# EAGLE design midi_in (EAGLE 5.07)
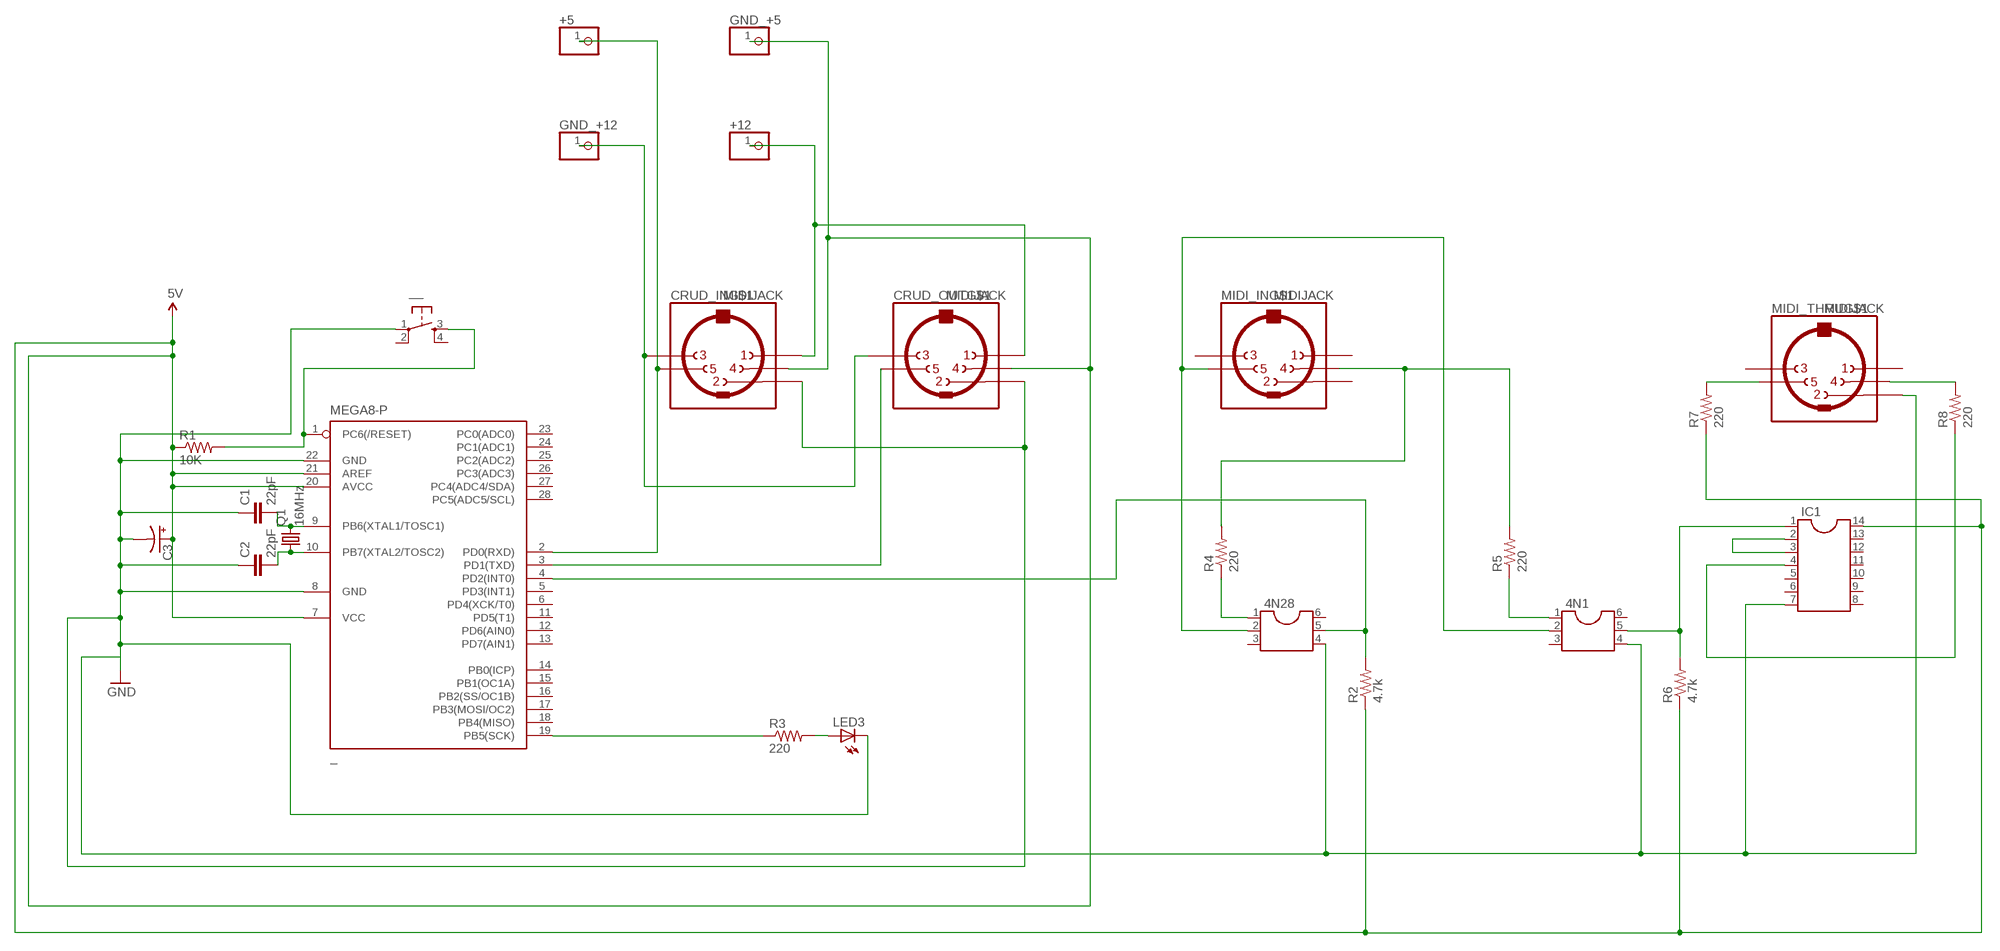
[diagram p0: schematic, sheet 1]

## Parts
4N1  DIL6  [DIL06]
4N28  DIL6  [DIL06]
+5  PINHD-1X1  [1X01]
+12  PINHD-1X1  [1X01]
_  MEGA8-P  [DIL28-3]
__  TAC_SWITCHPTH  [TACTILE-PTH]
C1  22pF  CAPPTH  [CAP-PTH-SMALL]
C2  22pF  CAPPTH  [CAP-PTH-SMALL]
C3  CAP_POLPTH2  [CPOL-RADIAL-10UF-25V]
CRUD_IN  MIDIJACK  [CP-2350]
CRUD_OUT  MIDIJACK  [CP-2350]
GND_+5  PINHD-1X1  [1X01]
GND_+12  PINHD-1X1  [1X01]
IC1  DIL14  [DIL14]
LED3  LED5MM  [LED5MM]
MIDI_IN  MIDIJACK  [CP-2350]
MIDI_THRU  MIDIJACK  [CP-2350]
Q1  16MHz  CRYSTALHC49U-V  [HC49U-V]
R1  10K  RESISTORPTH-1/6W  [1/6W-RES]
R2  4.7k  RESISTORPTH-1/6W  [1/6W-RES]
R3  220  RESISTORPTH-1/6W  [1/6W-RES]
R4  220  RESISTORPTH-1/6W  [1/6W-RES]
R5  220  RESISTORPTH-1/6W  [1/6W-RES]
R6  4.7k  RESISTORPTH-1/6W  [1/6W-RES]
R7  220  RESISTORPTH-1/6W  [1/6W-RES]
R8  220  RESISTORPTH-1/6W  [1/6W-RES]

## Nets
5V: _.7(VCC) _.20(AVCC) _.21(AREF) C3.1(+) CRUD_IN.4 CRUD_OUT.4 GND_+5.1 IC1.14 R1.1 R2.1 R6.1 R7.1
GND: 4N1.4 4N28.4 _.8(GND) _.22(GND) __.1 C1.1 C2.1 C3.2(-) CRUD_IN.2 CRUD_OUT.2 IC1.7 LED3.K(C) MIDI_THRU.2
N$1: _.1(PC6(/RESET)) __.3 R1.2
N$2: _.9(PB6(XTAL1/TOSC1)) C1.2 Q1.2
N$3: _.10(PB7(XTAL2/TOSC2)) C2.2 Q1.1
N$4: _.19(PB5(SCK)) R3.1
N$5: +5.1 _.2(PD0(RXD)) CRUD_IN.5
N$6: _.3(PD1(TXD)) CRUD_OUT.5
N$7: CRUD_IN.3 CRUD_OUT.3 GND_+12.1
N$8: +12.1 CRUD_IN.1 CRUD_OUT.1
N$9: 4N28.5 _.4(PD2(INT0)) R2.2
N$10: 4N28.1 R4.1
N$11: MIDI_IN.4 R4.2 R5.2
N$12: LED3.A R3.2
N$13: 4N1.2 4N28.2 MIDI_IN.5
N$15: 4N1.1 R5.1
N$16: 4N1.5 IC1.1 R6.2
N$18: IC1.2 IC1.3
N$19: MIDI_THRU.5 R7.2
N$20: MIDI_THRU.4 R8.2
N$22: IC1.4 R8.1
Unconnected: 4N1.3 4N1.6 4N28.3 4N28.6 _.5(PD3(INT1)) _.6(PD4(XCK/T0)) _.11(PD5(T1)) _.12(PD6(AIN0)) _.13(PD7(AIN1)) _.14(PB0(ICP)) _.15(PB1(OC1A)) _.16(PB2(SS/OC1B)) _.17(PB3(MOSI/OC2)) _.18(PB4(MISO)) _.23(PC0(ADC0)) _.24(PC1(ADC1)) _.25(PC2(ADC2)) _.26(PC3(ADC3)) _.27(PC4(ADC4/SDA)) _.28(PC5(ADC5/SCL)) __.2 __.4 CRUD_IN.PE1(MT) CRUD_IN.PE2(MT) CRUD_IN.PE(MT) CRUD_IN.PE@(MT) CRUD_OUT.PE1(MT) CRUD_OUT.PE2(MT) CRUD_OUT.PE(MT) CRUD_OUT.PE@(MT) IC1.5 IC1.6 IC1.8 IC1.9 IC1.10 IC1.11 IC1.12 IC1.13 MIDI_IN.1 MIDI_IN.2 MIDI_IN.3 MIDI_IN.PE1(MT) MIDI_IN.PE2(MT) MIDI_IN.PE(MT) MIDI_IN.PE@(MT) MIDI_THRU.1 MIDI_THRU.3 MIDI_THRU.PE1(MT) MIDI_THRU.PE2(MT) MIDI_THRU.PE(MT) MIDI_THRU.PE@(MT)

## Library data of the parts
4N1 4N28 = ic-package:DIL6: Dual In Line / Socket
+5 +12 GND_+5 GND_+12 = pinhead:PINHD-1X1: PIN HEADER
_ = atmel:MEGA8-P: MICROCONTROLLER 8 Kbytes FLASH, 1 kbytes SRAM, 512 bytes EEPROM, USART, 4-channel 10 bit ADC, 2-channel 8 bit ADC Pin compatible with Atmega48, ATMega88, ATMega168 Source: avr.lbr
__ = SparkFun:TAC_SWITCH: Momentary Switch Button commonly used for reset or general input. Spark Fun Electronics SKU : COM-00097
C1 C2 = SparkFun:CAP: Capacitor Standard 0603 ceramic capacitor, and 0.1" leaded capacitor.
C3 = SparkFun:CAP_POL: Capacitor Polarized These are standard SMD and PTH capacitors. Normally 10uF, 47uF, and 100uF in electrolytic and tantalum varieties. Always verify the external diameter of the through hole cap, it varies with capacity, voltage, and manufacturer. The EIA devices should be standard.
CRUD_IN CRUD_OUT MIDI_IN MIDI_THRU = adafruit:MIDIJACK: DIN 5 jack also known as MIDI jack A modification of conn-hirshman:MAB5SH with two options for the grounding 'teeth'
IC1 = ic-package:DIL14: Dual In Line / Socket
LED3 = adafruit:LED: LED OSRAM: - CHIPLED LG R971, LG N971, LY N971, LG Q971, LY Q971, LO R971, LY R971 LH N974, LH R974 LS Q976, LO Q976, LY Q976 LO Q996 - Hyper CHIPLED LW Q18S LB Q993, LB Q99A, LB R99A - SideLED LS A670, LO A670, LY A670, LG A670, LP A670 LB A673, LV A673, LT A673, LW A673 LH A674 LY A675 LS A676, LA A676, LO A676, LY A676, LW A676 LS A679, LY A679, LG A679 - Hyper Micro SIDELED® LS Y876, LA Y876, LO Y876, LY Y876 LT Y87S - SmartLED LW L88C, LW L88S LB L89C, LB L89S, LG L890 LS L89K, LO L89K, LY L89K LS L896, LA L896, LO L896, LY L896 - TOPLED LS T670, LO T670, LY T670, LG T670, LP T670 LSG T670, LSP T670, LSY T670, LOP T670, LYG T670 LG T671, LOG T671, LSG T671 LB T673, LV T673, LT T673, LW T673 LH T674 LS T676, LA T676, LO T676, LY T676, LB T676, LH T676, LSB T676, LW T676 LB T67C, LV T67C, LT T67C, LS T67K, LO T67K, LY T67K, LW E67C LS E67B, LA E67B, LO E67B, LY E67B, LB E67C, LV E67C, LT E67C LW T67C LS T679, LY T679, LG T679 LS T770, LO T770, LY T770, LG T770, LP T770 LB T773, LV T773, LT T773, LW T773 LH T774 LS E675, LA E675, LY E675, LS T675 LS T776, LA T776, LO T776, LY T776, LB T776 LHGB T686 LT T68C, LB T68C - Hyper Mini TOPLED® LB M676 - Mini TOPLED Santana® LG M470 LS M47K, LO M47K, LY M47K Source: http://www.osram.convergy.de/
Q1 = crystal:CRYSTAL: CRYSTAL
R1-R8 = SparkFun:RESISTOR: Resistor Basic schematic elements and footprints for 0603, 1206, and PTH resistors.

## Board
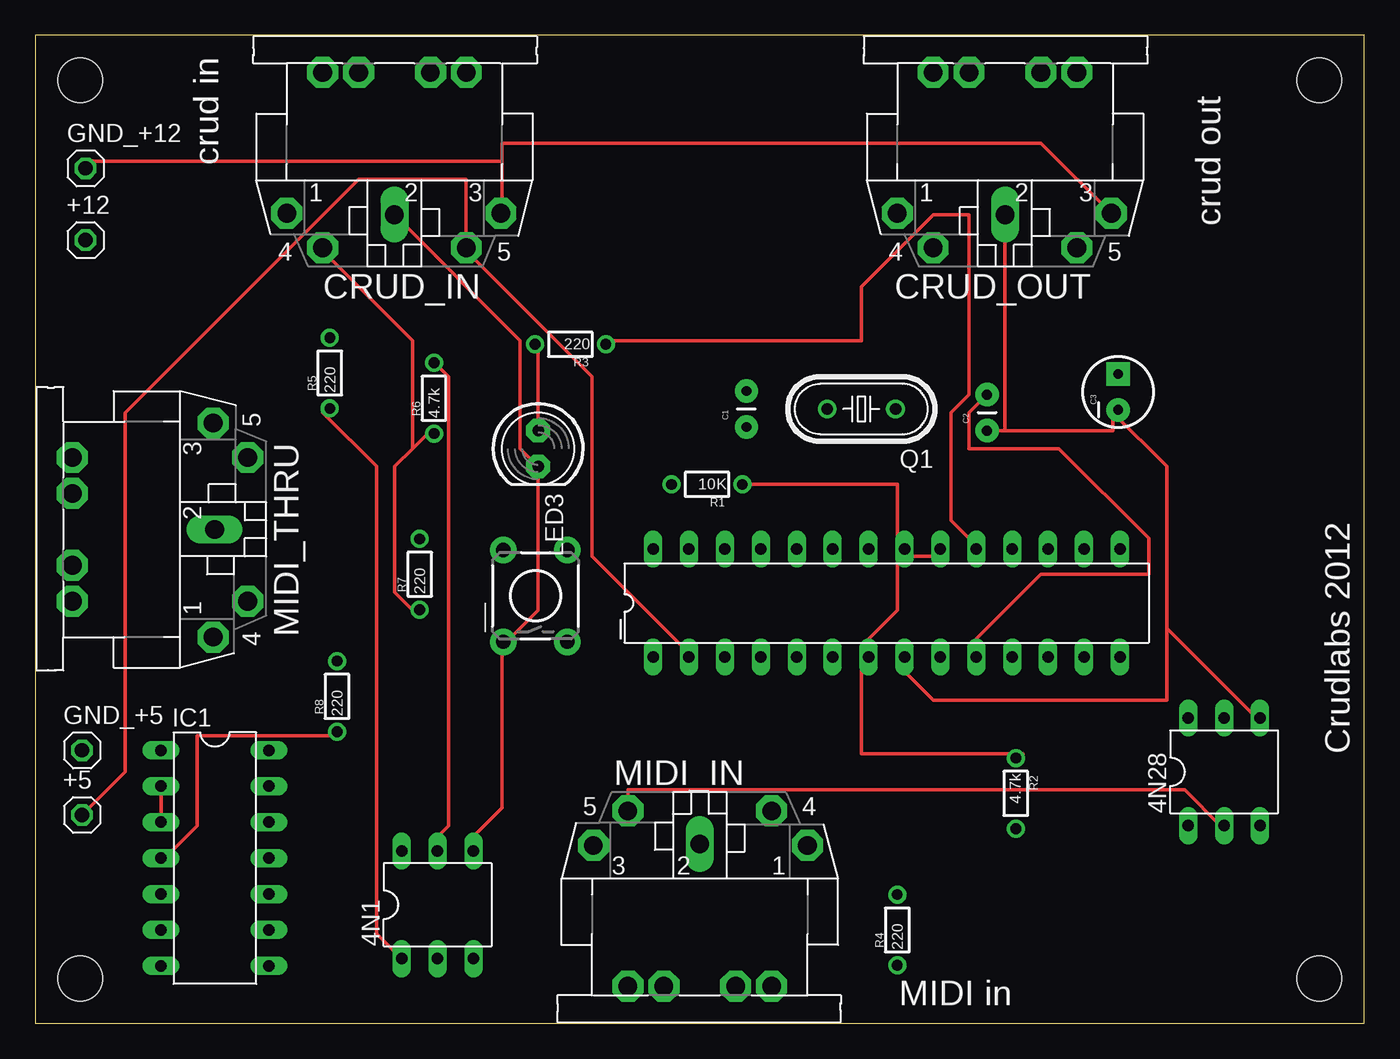
[diagram p1: board, top side]
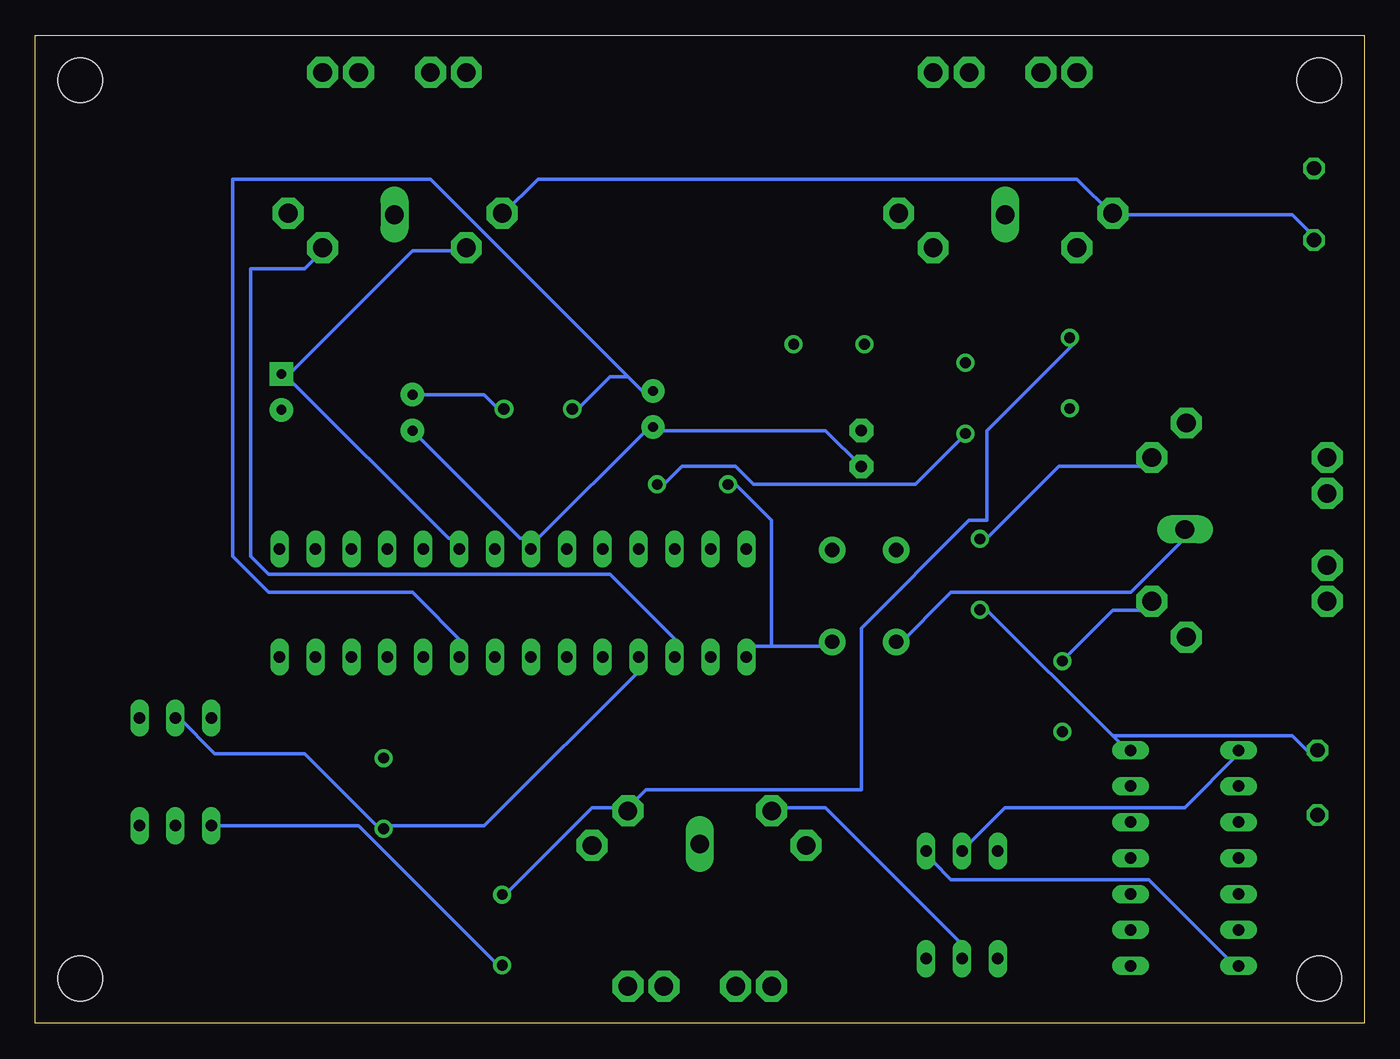
[diagram p2: board, bottom side, seen from below]

Size 93.98 x 69.85 mm. Coordinates in mm from the lower left corner, seen from the top.
Outline: 0,0 93.98,0 93.98,69.85 0,69.85 0,0
Copper layers (1*16): Top 0.035mm / dielectric 1.5mm / Bottom 0.035mm
Design rules "default": minimum track width 10mil, minimum drill 24mil, track to track 8mil, track to pad 8mil, pad to pad 8mil, via to via 8mil, smd to smd 8mil, copper to edge 40mil, drill to drill 8mil, minimum pad ring 10mil, minimum via ring 8mil, stop-mask expansion 4mil, vias tented up to drill 0mil, thermal gap 10mil
Holes 3.17 mm at 3.17,66.67 90.81,3.17 90.81,66.67 3.17,3.17

### Footprints (pad centres in the part's own frame; a part is rotated, then mirrored left to right if it is on the bottom)
DIL06 = drill 0.813 long: 1 -2.54,-3.81; 2 0,-3.81; 3 2.54,-3.81; 4 2.54,3.81; 5 0,3.81; 6 -2.54,3.81
1X01 = drill 1.016 octagon: 1 0,0
DIL28-3 = drill 0.813 long: 1 -16.51,-3.81; 2 -13.97,-3.81; 3 -11.43,-3.81; 4 -8.89,-3.81; 5 -6.35,-3.81; 6 -3.81,-3.81; 7 -1.27,-3.81; 8 1.27,-3.81; 9 3.81,-3.81; 10 6.35,-3.81; 11 8.89,-3.81; 12 11.43,-3.81; 13 13.97,-3.81; 14 16.51,-3.81; 15 16.51,3.81; 16 13.97,3.81; 17 11.43,3.81; 18 8.89,3.81; 19 6.35,3.81; 20 3.81,3.81; 21 1.27,3.81; 22 -1.27,3.81; 23 -3.81,3.81; 24 -6.35,3.81; 25 -8.89,3.81; 26 -11.43,3.81; 27 -13.97,3.81; 28 -16.51,3.81
TACTILE-PTH = drill 1.016 pad 1.88 round: 1 -3.251,2.261; 2 3.251,2.261; 3 -3.251,-2.261; 4 3.251,-2.261
CAP-PTH-SMALL = drill 0.7 pad 1.651 round: 1 0,0; 2 2.54,0
CPOL-RADIAL-10UF-25V = drill 0.7 pad 1.651 square: 1 1.27,0 | drill 0.7 pad 1.651 round: 2 -1.27,0
CP-2350 = drill 1.321 pad 2.184 octagon: 1 7.62,12.58; 3 -7.52,12.58; 4 5.08,15.02; 5 -5.08,15.02; PE -2.54,2.62; PE1 -5.08,2.62; PE2 5.08,2.62; PE@ 2.54,2.62 | drill 1.321 long: 2 0,12.68
DIL14 = drill 0.813 long: 1 -7.62,-3.81; 2 -5.08,-3.81; 3 -2.54,-3.81; 4 0,-3.81; 5 2.54,-3.81; 6 5.08,-3.81; 7 7.62,-3.81; 8 7.62,3.81; 9 5.08,3.81; 10 2.54,3.81; 11 0,3.81; 12 -2.54,3.81; 13 -5.08,3.81; 14 -7.62,3.81
LED5MM = drill 0.813 pad 1.676 octagon: A -1.27,0; K 1.27,0
HC49U-V = drill 0.813 round: 1 -2.413,0; 2 2.413,0
1/6W-RES = drill 0.762 round: 1 -2.5,0; 2 2.5,0

### Placement (x,y rotation side)
4N1  28.45,8.38 0 top
4N28  84.07,17.78 0 top
+5  3.3,14.73 0 top
+12  3.56,55.37 0 top
_  60.2,29.72 0 top
__  35.37,30.23 90 top
C1  50.29,42.16 90 top
C2  67.31,41.91 90 top
C3  76.58,44.64 90 top
CRUD_IN  25.4,69.85 180 top
CRUD_OUT  68.58,69.85 180 top
GND_+5  3.3,19.3 0 top
GND_+12  3.56,60.45 0 top
IC1  12.7,11.68 270 top
LED3  35.56,40.64 270 top
MIDI_IN  46.99,0 0 top
MIDI_THRU  0,34.92 270 top
Q1  58.42,43.43 180 top
R1  47.5,38.1 180 top
R2  69.34,16.26 270 top
R3  37.85,48.01 180 top
R4  60.96,6.6 90 top
R5  20.83,45.97 90 top
R6  28.19,44.2 90 top
R7  27.18,31.75 90 top
R8  21.34,23.11 90 top
U$3  [CRUDLABS_LOGO_1]  46.48,61.98 0 top

### Tracks (layer width: path | path; a pad name or v marks a point on that pad's centre or on a via)
5V
  Top 0.254: 26.67,40.64 25.4,39.37 25.4,30.48 26.67,29.21 R7.1 | 26.67,40.64 27.94,41.91 R6.1 | 26.67,40.64 26.67,48.26 20.32,54.61 CRUD_IN.4 | R2.1 69.85,19.05 58.42,19.05 58.42,25.4 _.7 58.42,26.67 60.96,29.21 60.96,33.02 | 49.53,38.1 R1.1 60.96,38.1 60.96,34.29 _.21 60.96,33.02 | 60.96,33.02 63.5,33.02 _.20
  Bottom 0.254: 17.78,20.32 16.51,19.05 IC1.14 | 17.78,20.32 26.67,29.21 R7.1 | 17.78,20.32 5.08,20.32 3.81,19.05 GND_+5.1 | 76.2,45.72 67.31,54.61 63.5,54.61 CRUD_OUT.4 | 76.2,45.72 64.77,34.29 63.5,34.29 _.20 | 76.2,45.72 C3.1 | R6.1 27.94,41.91 31.75,38.1 43.18,38.1 44.45,39.37 48.26,39.37 49.53,38.1 R1.1
GND
  Top 0.254: 80.01,27.94 86.36,21.59 4N28.4 | 80.01,27.94 80.01,39.37 76.2,43.18 | 80.01,27.94 80.01,22.86 63.5,22.86 60.96,25.4 _.8 | 68.58,41.91 76.2,41.91 76.2,43.18 | C2.1 68.58,41.91 | 76.2,43.18 C3.2 | 68.58,41.91 CRUD_OUT.2 | 33.02,26.67 35.56,29.21 LED3.K 34.29,40.64 34.29,48.26 25.4,57.15 CRUD_IN.2 | 33.02,26.67 33.02,15.24 30.48,12.7 4N1.4 | 33.02,26.67 __.1
  Bottom 0.254: IC1.7 8.89,3.81 15.24,10.16 29.21,10.16 30.48,11.43 4N1.4 | 58.42,34.29 50.8,41.91 C1.1 49.53,41.91 38.1,41.91 LED3.K | MIDI_THRU.2 12.7,34.29 16.51,30.48 29.21,30.48 33.02,26.67 __.1 | C2.1 59.69,34.29 58.42,34.29 | 58.42,34.29 _.22
N$1
  Bottom 0.254: 41.91,26.67 41.91,35.56 44.45,38.1 R1.2 | 41.91,26.67 43.18,26.67 _.1 | 41.91,26.67 38.1,26.67 __.3
N$2
  Bottom 0.254: 52.07,45.72 50.8,44.45 C1.2 | 52.07,45.72 66.04,59.69 80.01,59.69 80.01,33.02 77.47,30.48 67.31,30.48 63.5,26.67 _.9 | 52.07,45.72 53.34,45.72 55.88,43.18 Q1.2
N$3
  Top 0.254: C2.2 66.04,43.18 66.04,40.64 72.39,40.64 78.74,34.29 78.74,31.75 71.12,31.75 66.04,26.67 _.10
  Bottom 0.254: C2.2 62.23,44.45 60.96,43.18 Q1.1
N$4
  Top 0.254: R3.1 40.64,48.26 58.42,48.26 58.42,52.07 63.5,57.15 66.04,57.15 66.04,44.45 64.77,43.18 64.77,35.56 66.04,34.29 _.19
N$5
  Top 0.254: _.2 45.72,26.67 39.37,33.02 39.37,45.72 30.48,54.61 CRUD_IN.5 30.48,59.69 22.86,59.69 6.35,43.18 6.35,17.78 +5.1
N$6
  Bottom 0.254: _.3 48.26,26.67 53.34,31.75 77.47,31.75 78.74,33.02 78.74,53.34 74.93,53.34 73.66,54.61 CRUD_OUT.5
N$7
  Top 0.254: 33.02,60.96 3.81,60.96 GND_+12.1 | 33.02,60.96 33.02,57.15 CRUD_IN.3 | 33.02,60.96 33.02,62.23 71.12,62.23 76.2,57.15 CRUD_OUT.3
N$8
  Bottom 0.254: 17.78,57.15 5.08,57.15 3.81,55.88 +12.1 | 17.78,57.15 20.32,59.69 58.42,59.69 60.96,57.15 CRUD_OUT.1 | 17.78,57.15 CRUD_IN.1
N$9
  Bottom 0.254: 69.85,13.97 74.93,19.05 81.28,19.05 83.82,21.59 4N28.5 | 69.85,13.97 62.23,13.97 50.8,25.4 _.4 | 69.85,13.97 R2.2
N$10
  Bottom 0.254: R4.1 60.96,3.81 71.12,13.97 4N28.1
N$11
  Bottom 0.254: 52.07,15.24 50.8,16.51 35.56,16.51 35.56,27.94 27.94,35.56 26.67,35.56 26.67,41.91 20.32,48.26 R5.2 | 52.07,15.24 54.61,15.24 60.96,8.89 R4.2 | 52.07,15.24 MIDI_IN.4
N$12
  Top 0.254: LED3.A 35.56,48.26 R3.2
N$13
  Top 0.254: 4N28.2 83.82,13.97 81.28,16.51 41.91,16.51 MIDI_IN.5
  Bottom 0.254: 4N1.2 27.94,5.08 38.1,15.24 41.91,15.24 MIDI_IN.5
N$15
  Top 0.254: R5.1 20.32,43.18 24.13,39.37 24.13,6.35 4N1.1
N$16
  Top 0.254: R6.2 27.94,46.99 29.21,45.72 29.21,13.97 27.94,12.7 4N1.5
  Bottom 0.254: IC1.1 8.89,19.05 12.7,15.24 25.4,15.24 4N1.5
N$18
  Top 0.254: 8.89,13.97 IC1.3 IC1.2
N$19
  Bottom 0.254: R7.2 26.67,34.29 21.59,39.37 15.24,39.37 MIDI_THRU.5
N$20
  Bottom 0.254: R8.2 21.59,25.4 17.78,29.21 15.24,29.21 MIDI_THRU.4
N$22
  Top 0.254: R8.1 21.59,20.32 11.43,20.32 11.43,13.97 8.89,11.43 IC1.4

### Text on the board
tPlace: crud in | crud out | Crudlabs 2012 | MIDI in